# EAGLE design alimentaçao3 (EAGLE 9.6.2)
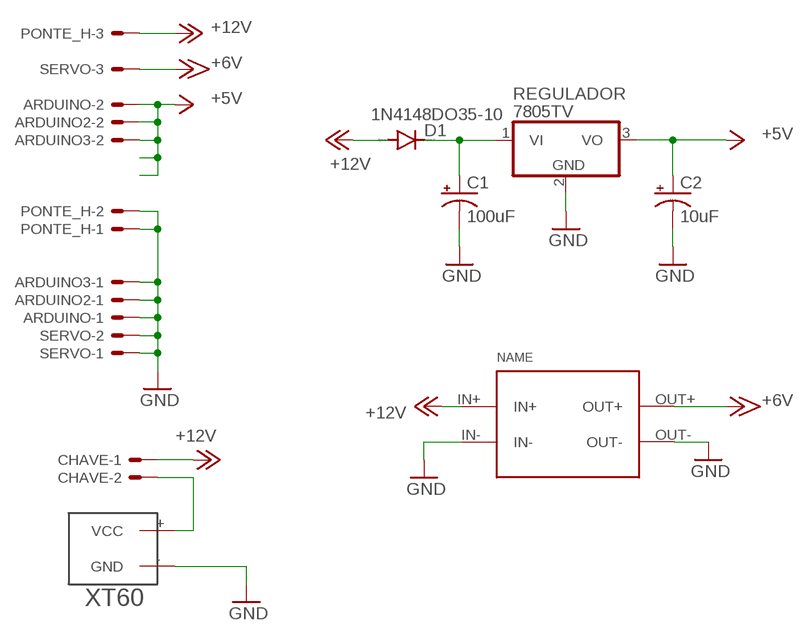
[diagram p0: schematic, sheet 1]

## Parts
ARDUINO  KK-156-2  [KK-156-2]
ARDUINO2  KK-156-2  [KK-156-2]
ARDUINO3  KK-156-2  [KK-156-2]
BUCK  CP8-ADJ  [CP8-ADJ]
C1  100uF  CPOL-USE5-4  [E5-4]
C2  10uF  CPOL-USE5-4  [E5-4]
CHAVE  KK-156-2  [KK-156-2]
D1  1N4148DO35-10  [DO35-10]
PONTE_H  KK-156-3  [KK-156-3]
REGULADOR  7805TV  [TO220V]
SERVO  KK-156-3  [KK-156-3]
U$1  XT60  [XT60]

## Nets
+5V: ARDUINO2.2 ARDUINO3.2 ARDUINO.2 C2.+ REGULADOR.3(VO)
+6V: BUCK.OUT+ SERVO.3
+12V: BUCK.IN+ CHAVE.1 D1.A PONTE_H.3
GND: ARDUINO2.1 ARDUINO3.1 ARDUINO.1 BUCK.IN- BUCK.OUT- C1.- C2.- PONTE_H.1 PONTE_H.2 REGULADOR.2(GND) SERVO.1 SERVO.2 U$1.-(GND)
N$1: CHAVE.2 U$1.+(VCC)
N$2: C1.+ D1.C REGULADOR.1(VI)

## Library data of the parts
ARDUINO ARDUINO2 ARDUINO3 CHAVE = con-molex:KK-156-2: KK 156 HEADER Source: http://www.molex.com/pdm_docs/sd/026604100_sd.pdf; MF: MOLEX; OC_FARNELL: unknown; OC_NEWARK: unknown
BUCK = userlib:CP8-ADJ: Voltage regulator IN: 7-35V OUT: ADJ
C1 C2 = rcl_robotica:CPOL-US: POLARIZED CAPACITOR, American symbol; SPICEPREFIX: C
D1 = diode:1N4148: DIODE high speed (Philips)
PONTE_H SERVO = con-molex:KK-156-3: KK 156 HEADER Source: http://www.molex.com/pdm_docs/sd/026604100_sd.pdf; MF: MOLEX; OC_FARNELL: unknown; OC_NEWARK: unknown
REGULADOR = linear:78*: Positive VOLTAGE REGULATOR Source: http://cache.national.com/ds/LM/LM78L05.pdf http://www.fairchildsemi.com/ds/LM/LM7805.pdf
U$1 = XT60 (1):XT60: XT60

## Board
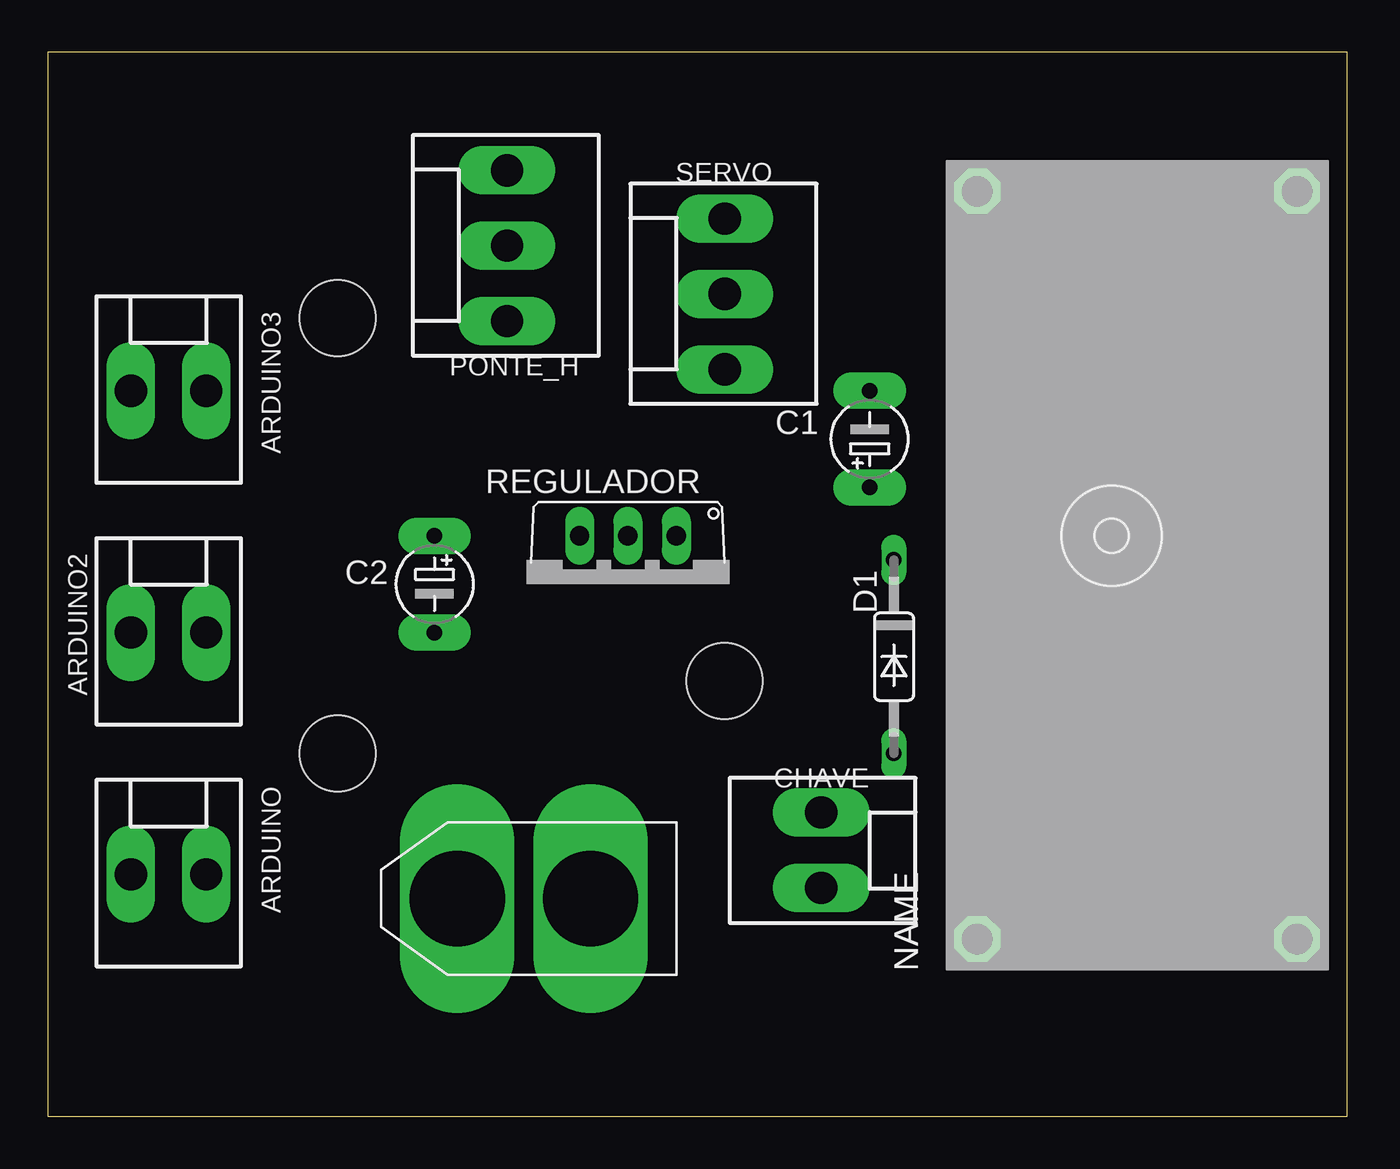
[diagram p1: board, top side]
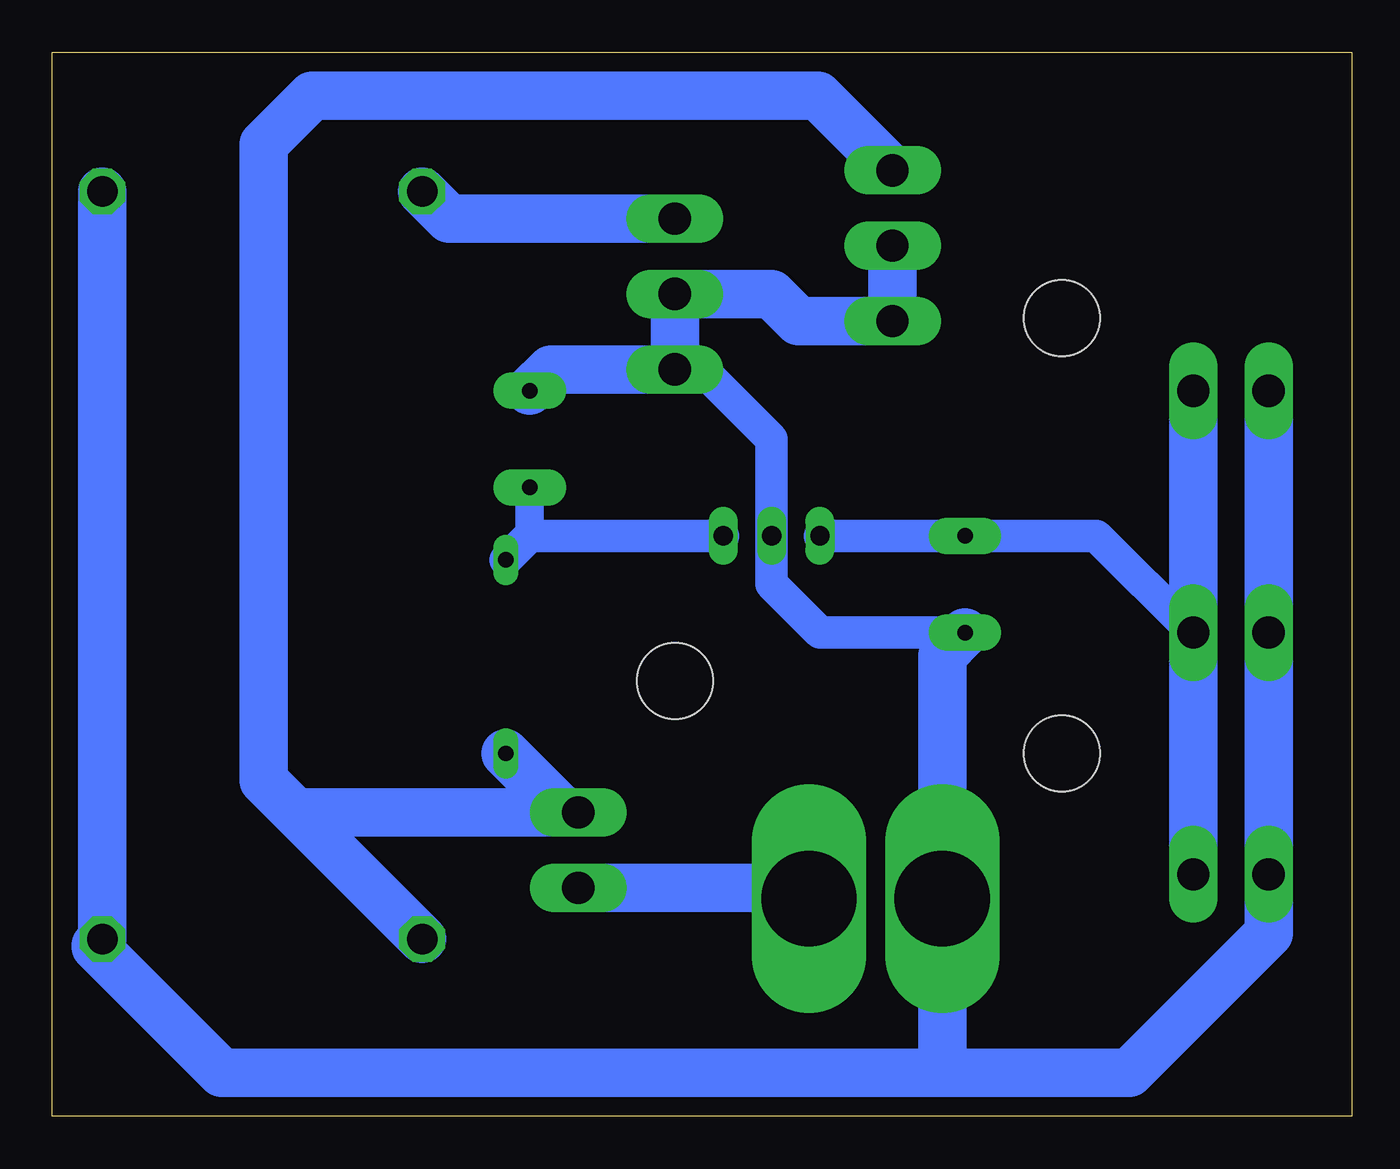
[diagram p2: board, bottom side, seen from below]

Size 68.25 x 55.87 mm. Coordinates in mm from the lower left corner, seen from the top.
Outline: 0,0 68.25,0 68.25,55.87 0,55.87 0,0
Copper layers (1*16): Top 0.035mm / dielectric 1.5mm / Bottom 0.035mm
Design rules "default *": minimum track width 30mil, minimum drill 0.35mm, track to track 32mil, track to pad 25mil, pad to pad 25mil, via to via 25mil, smd to smd 25mil, copper to edge 40mil, drill to drill 10mil, minimum pad ring 10mil, minimum via ring 8mil, stop-mask expansion 4mil, vias tented up to drill 0mil, thermal gap 0mil
Holes 4 mm at 35.56,22.86 15.24,41.91 15.24,19.05

### Footprints (pad centres in the part's own frame; a part is rotated, then mirrored left to right if it is on the bottom)
KK-156-2 = drill 1.7 pad 2.184 long: 1 -1.98,0; 2 1.98,0
CP8-ADJ = drill 1.6 octagon: IN+ -21.175,7.05; IN- -21.175,-9.75; OUT+ 18.085,7.05; OUT- 18.085,-9.75
E5-4 = drill 0.813 pad 1.905 long: + -2.54,0; - 2.54,0
DO35-10 = drill 0.813 long: A 5.08,0; C -5.08,0
KK-156-3 = drill 1.7 pad 2.184 long: 1 -3.96,0; 2 0,0; 3 3.96,0
TO220V = drill 1.016 long: 1 -2.54,-2.54; 2 0,-2.54; 3 2.54,-2.54
XT60 = drill 5 long: + 4.5,0; - 11.5,0

### Placement (x,y rotation side)
ARDUINO  6.35,12.7 0 top
ARDUINO2  6.35,25.4 0 top
ARDUINO3  6.35,38.1 0 top
BUCK  55.88,30.48 90 top
C1  43.18,35.56 90 top
C2  20.32,27.94 270 top
CHAVE  40.64,13.97 270 top
D1  44.45,24.13 270 top
PONTE_H  24.13,45.72 90 top
REGULADOR  30.48,27.94 180 top
SERVO  35.56,43.18 90 top
U$1  33.02,11.43 180 top

### Tracks (layer width: path | path; a pad name or v marks a point on that pad's centre or on a via)
+5V
  Bottom 1.7: REGULADOR.3 C2.+ 13.41,30.48 ARDUINO2.2
  Bottom 2.54: ARDUINO3.2 ARDUINO2.2 ARDUINO.2
+6V
  Bottom 2.54: SERVO.3 47.41,47.14 BUCK.OUT+
+12V
  Bottom 2.54: D1.A 41.35,15.95 CHAVE.1 55.17,15.95 55.32,15.8 | PONTE_H.3 28.03,53.58 54.61,53.58 57.15,51.04 57.15,17.62 55.32,15.8 | BUCK.IN+ 55.32,15.8
GND
  Bottom 1.7: C2.- 27.94,25.4 30.48,27.94 REGULADOR.2 30.48,35.56 34.29,39.37 35.41,39.37 SERVO.1
  Bottom 2.54: 21.59,2.29 59.36,2.29 65.96,8.89 65.96,8.97 BUCK.IN- BUCK.OUT- | 21.59,2.29 11.68,2.29 4.37,9.6 ARDUINO.1 ARDUINO2.1 ARDUINO3.1 | 21.52,2.36 21.59,2.29 | PONTE_H.2 PONTE_H.1 29.06,41.76 30.48,43.18 SERVO.2 SERVO.1 42.06,39.22 C1.- | C2.- 21.52,24.2 U$1.- 21.52,2.61 21.59,2.54 21.59,2.29
N$1
  Bottom 2.54: U$1.+ 29.08,11.99 CHAVE.2
N$2
  Bottom 1.5: C1.+ 43.18,30.48
  Bottom 1.7: REGULADOR.1 43.18,30.48 D1.C